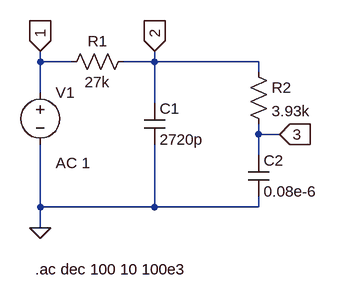
[diagram p0: schematic RC network.asc]
RC network.asc, the LTspice schematic file:
Version 4
SHEET 1 880 680
WIRE -128 64 -128 48
WIRE -80 64 -128 64
WIRE 48 64 48 48
WIRE 48 64 0 64
WIRE 208 64 48 64
WIRE 208 80 208 64
WIRE -128 112 -128 64
WIRE 48 128 48 64
WIRE 208 176 208 160
WIRE 240 176 208 176
WIRE 208 208 208 176
WIRE -128 288 -128 192
WIRE 48 288 48 192
WIRE 48 288 -128 288
WIRE 208 288 208 272
WIRE 208 288 48 288
WIRE -128 320 -128 288
FLAG -128 320 0
FLAG -128 48 1
IOPIN -128 48 In
FLAG 48 48 2
IOPIN 48 48 In
FLAG 240 176 3
IOPIN 240 176 In
SYMBOL cap 32 128 R0
SYMATTR InstName C1
SYMATTR Value 2720p
SYMBOL res 16 48 R90
WINDOW 0 0 56 VBottom 2
WINDOW 3 32 56 VTop 2
SYMATTR InstName R1
SYMATTR Value 27k
SYMBOL res 192 64 R0
SYMATTR InstName R2
SYMATTR Value 3.93k
SYMBOL cap 192 208 R0
SYMATTR InstName C2
SYMATTR Value 0.08e-6
SYMBOL voltage -128 96 R0
WINDOW 123 24 124 Left 2
WINDOW 39 0 0 Left 0
SYMATTR InstName V1
SYMATTR Value ""
SYMATTR Value2 AC 1
TEXT -136 384 Left 2 !.ac dec 100 10 100e3

The netlist it stands for:
* RC network.asc
C1 2 0 2720p
R1 2 1 27k
R2 2 3 3.93k
C2 3 0 0.08e-6
V1 1 0 AC 1
.ac dec 100 10 100e3
.backanno
.end